# Altium schematic sheet Power.SchDoc
size A
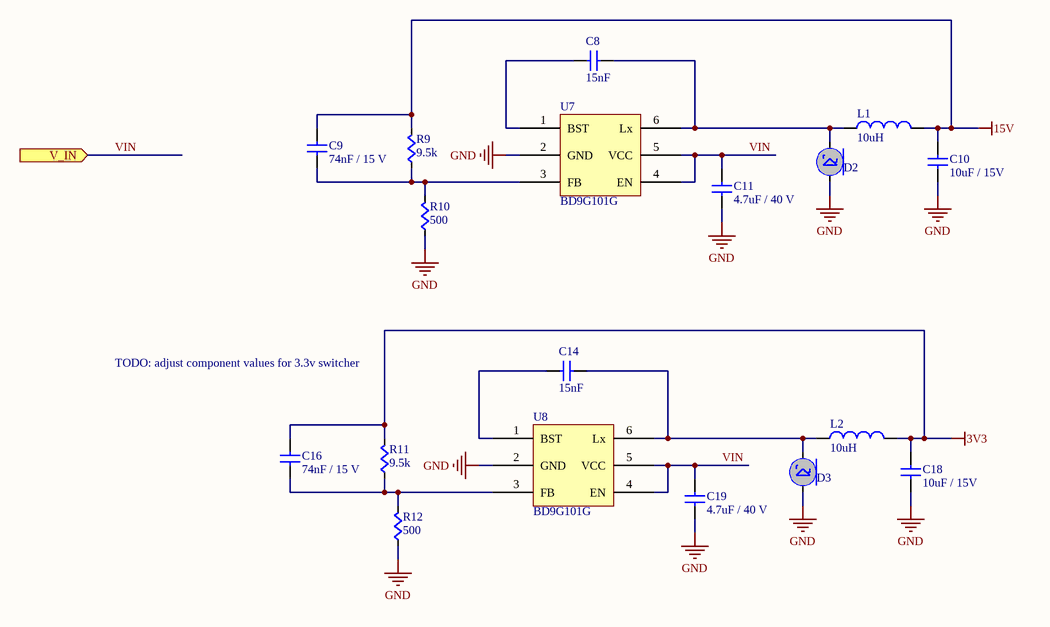
[diagram p0: Power.SchDoc]

## Parts
C8  value 15nF  [CAPC0603]  (hidden comment: Cap)
C9  value 74nF / 15 V  [CAPC0603]  (hidden comment: Cap)
C10  value 10uF / 15V  [CAPC0805]  (hidden comment: Cap)
C11  value 4.7uF / 40 V  [CAPC0805]  (hidden comment: Cap)
C14  value 15nF  [CAPC0603]  (hidden comment: Cap)
C16  value 74nF / 15 V  [CAPC0603]  (hidden comment: Cap)
C18  value 10uF / 15V  [CAPC0805]  (hidden comment: Cap)
C19  value 4.7uF / 40 V  [CAPC0805]  (hidden comment: Cap)
D2  Schottky  [US1K-13-F]  (value not drawn)
D3  Schottky  [US1K-13-F]  (value not drawn)
L1  Inductance: 10uH  [CAPC0805]  (hidden comment: Inductor)
L2  Inductance: 10uH  [CAPC0805]  (hidden comment: Inductor)
R9  value 9.5k  [RES0603]  (hidden comment: Res)
R10  value 500  [RES0603]  (hidden comment: Res)
R11  value 9.5k  [RES0603]  (hidden comment: Res)
R12  value 500  [RES0603]  (hidden comment: Res)
U7  BD9G101G  [BD9G101G]
U8  BD9G101G  [BD9G101G]

## Ports
V_IN (in)

## Nets
3V3: C16.2(B) C18.1(A) L2.2(B) R11.1(A)
15V: C9.2(B) C10.1(A) L1.2(B) R9.1(A)
GND: C10.2(B) C11.2(B) C18.2(B) C19.2(B) D2.A D3.A R10.2(B) R12.2(B) U7.2(GND) U8.2(GND)
VIN: C11.1(A) C19.1(A) U7.4(EN) U7.5(VCC) U8.4(EN) U8.5(VCC) ; port V_IN
NetC8_1: C8.1(A) U7.1(BST)
NetC8_2: C8.2(B) D2.C L1.1(A) U7.6(Lx)
NetC9_1: C9.1(A) R9.2(B) R10.1(A) U7.3(FB)
NetC14_1: C14.1(A) U8.1(BST)
NetC14_2: C14.2(B) D3.C L2.1(A) U8.6(Lx)
NetC16_1: C16.1(A) R11.2(B) R12.1(A) U8.3(FB)

## Notes on the sheet
- TODO: adjust component values for 3.3v switcher

## Library data of the parts
D2 D3 = Schottky: Schottky Diode Template; Supplier 1: Digi-Key; Supplier Part Number 1: 497-2461-1-ND
U7 U8 = BD9G101G: Simple Step-down Switching Regulators with Built-in Power MOSFET; Supplier 1: Digi-Key; Supplier Part Number 1: BD9G101G-CT-ND
C8-C11 C14 C16 C18 C19 = Cap: Supplier 1: Digi-Key
  C8 C14: Supplier Part Number 1: 1276-1967-1-ND
  C9 C16: Supplier Part Number 1: 1276-1814-1-ND
  C10 C18: Supplier Part Number 1: 490-7207-1-ND
  C11 C19: Supplier Part Number 1: 1276-1248-1-ND
L1 L2 = Inductor: Supplier Part Number 1: 445-8656-1-ND; Supplier 1: Digi-Key
R9-R12 = Res: Supplier 1: Digi-Key
  R9 R11: Supplier Part Number 1: RR08P9.53KDCT-ND
  R10 R12: Supplier Part Number 1: RR08P499DCT-ND